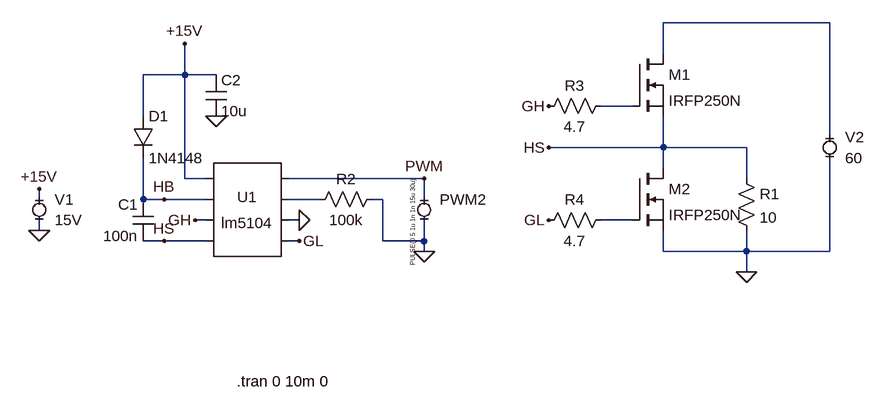
[diagram p0: schematic driver.asc]
driver.asc, the LTspice schematic file:
Version 4
SHEET 1 880 680
WIRE 640 -96 384 -96
WIRE 384 -48 384 -96
WIRE -352 -16 -352 -64
WIRE -352 -16 -416 -16
WIRE -304 -16 -352 -16
WIRE 336 32 288 32
WIRE -416 48 -416 -16
WIRE 640 80 640 -96
WIRE 384 96 384 48
WIRE 384 96 208 96
WIRE 512 96 384 96
WIRE 384 128 384 96
WIRE -352 144 -352 -16
WIRE -320 144 -352 144
WIRE 16 144 -192 144
WIRE 512 144 512 96
WIRE -576 176 -576 160
WIRE -416 176 -416 112
WIRE -384 176 -416 176
WIRE -320 176 -384 176
WIRE -144 176 -192 176
WIRE -48 176 -64 176
WIRE 16 176 16 144
WIRE -320 208 -336 208
WIRE -176 208 -192 208
WIRE 336 208 288 208
WIRE -576 224 -576 208
WIRE -384 240 -416 240
WIRE -320 240 -384 240
WIRE -176 240 -192 240
WIRE -48 240 -48 176
WIRE 16 240 16 208
WIRE 16 240 -48 240
WIRE 16 256 16 240
WIRE 384 256 384 224
WIRE 512 256 512 224
WIRE 512 256 384 256
WIRE 640 256 640 112
WIRE 640 256 512 256
WIRE 512 288 512 256
FLAG 208 32 GH
FLAG 208 208 GL
FLAG 208 96 HS
FLAG 512 288 0
FLAG -576 160 +15V
FLAG 16 256 0
FLAG -576 224 0
FLAG -176 208 0
FLAG -352 -64 +15V
FLAG -384 176 HB
FLAG -384 240 HS
FLAG -176 240 GL
FLAG -336 208 GH
FLAG 16 144 PWM
FLAG -304 48 0
SYMBOL MiniSyms4\\voltage- 16 192 R0
WINDOW 3 -17 -49 VRight 0
WINDOW 123 0 0 Left 0
WINDOW 39 7 17 Left 0
SYMATTR Value PULSE(0 5 1u 1n 1n 15u 30u)
SYMATTR InstName PWM2
SYMBOL MiniSyms4\\voltage- -576 192 R0
WINDOW 123 0 0 Left 0
WINDOW 39 7 17 Left 0
SYMATTR InstName V1
SYMATTR Value 15V
SYMBOL res 496 128 R0
SYMATTR InstName R1
SYMATTR Value 10
SYMBOL MiniSyms4\\voltage- 640 96 R0
WINDOW 123 0 0 Left 0
WINDOW 39 0 0 Left 0
SYMATTR InstName V2
SYMATTR Value 60
SYMBOL cap -400 240 R180
WINDOW 0 24 56 Left 2
WINDOW 3 24 8 Left 2
SYMATTR InstName C1
SYMATTR Value 100n
SYMBOL AutoGenerated\\lm5104 -256 192 R0
SYMATTR InstName U1
SYMBOL res 304 16 R90
WINDOW 0 0 56 VBottom 2
WINDOW 3 32 56 VTop 2
SYMATTR InstName R3
SYMATTR Value 4.7
SYMBOL res 304 192 R90
WINDOW 0 0 56 VBottom 2
WINDOW 3 32 56 VTop 2
SYMATTR InstName R4
SYMATTR Value 4.7
SYMBOL res -48 160 R90
WINDOW 0 0 56 VBottom 2
WINDOW 3 32 56 VTop 2
SYMATTR InstName R2
SYMATTR Value 100k
SYMBOL diode -432 48 R0
SYMATTR InstName D1
SYMATTR Value 1N4148
SYMBOL cap -320 -16 R0
SYMATTR InstName C2
SYMATTR Value 10u
SYMBOL nmos 336 -48 R0
SYMATTR InstName M1
SYMATTR Value IRFP250N
SYMBOL nmos 336 128 R0
SYMATTR InstName M2
SYMATTR Value IRFP250N
TEXT -272 456 Left 2 !.tran 0 10m 0

The netlist it stands for:
* driver.asc
V§PWM2 PWM 0 PULSE(0 5 1u 1n 1n 15u 30u)
V1 +15V 0 15V
R1 HS 0 10
V2 N001 0 60
C1 HS HB 100n
* U1: lm5104 (symbol AutoGenerated\lm5104 not available, pins judged from their places): pin1=+15V pin2=HB pin3=GH pin4=HS pin5=PWM pin6=N003 pin7=0 pin8=GL
R3 N002 GH 4.7
R4 N004 GL 4.7
R2 0 N003 100k
D1 +15V HB 1N4148
C2 +15V 0 10u
M1 N001 N002 HS HS IRFP250N
M2 HS N004 0 0 IRFP250N
.model D D
.lib standard.dio
.model NMOS NMOS
.model PMOS PMOS
.lib standard.mos
.tran 0 10m 0
.backanno
.end